# Altium schematic sheet LED7SEG.SchDoc
size A4
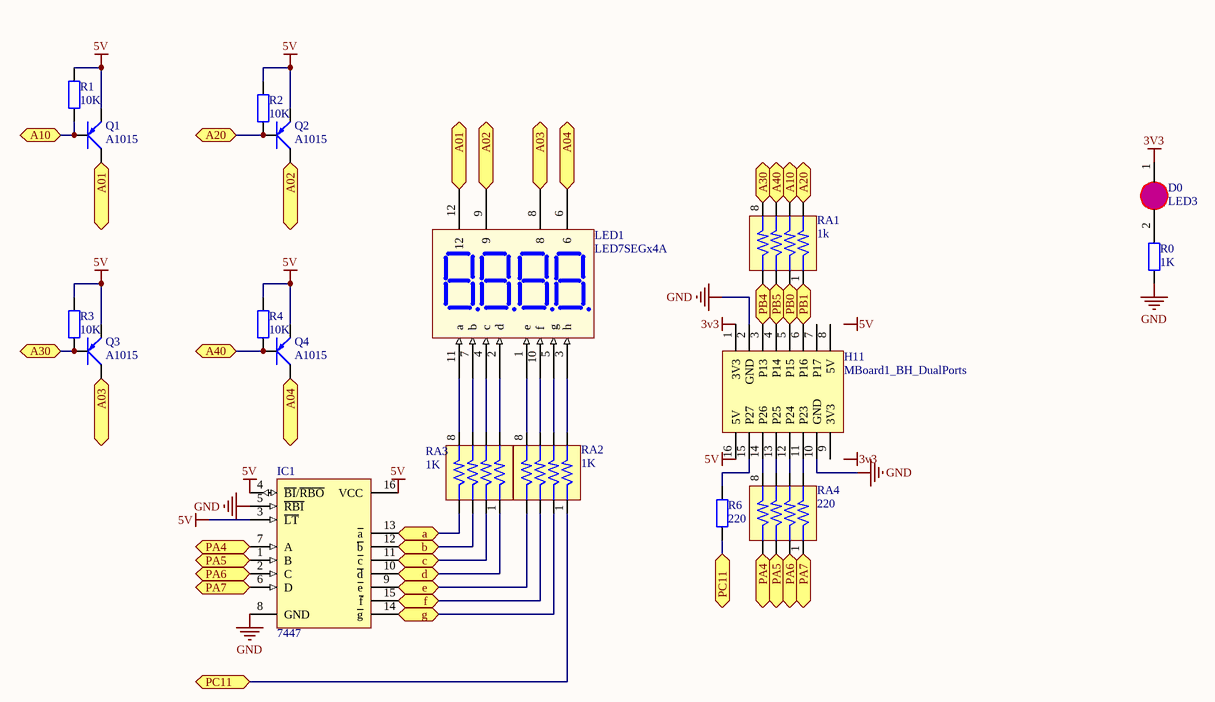
[diagram p0: LED7SEG.SchDoc]

## Parts
D0  LED3  [SMD0805LED]
H11  MBoard1_BH_DualPorts  [MBoard1_BH_DualPorts]
IC1  7447  [DIP16/W0.3]
LED1  LED7SEGx4A  [LED7SEGx4A]
Q1  A1015  [SOT23B]
Q2  A1015  [SOT23B]
Q3  A1015  [SOT23B]
Q4  A1015  [SOT23B]
R0  value 1K  [SMD0805R]  (hidden comment: R)
R1  value 10K  [SMD0805R]  (hidden comment: R)
R2  value 10K  [SMD0805R]  (hidden comment: R)
R3  value 10K  [SMD0805R]  (hidden comment: R)
R4  value 10K  [SMD0805R]  (hidden comment: R)
R6  value 220  [SMD0805R]  (hidden comment: R)
RA1  1k  [RA4]
RA2  1K  [RA4]
RA3  1K  [RA4]
RA4  220  [RA4]

## Ports
a, A01, A02, A03, A04, A10, A20, A30, A40, b, c, d, e, f, g, PA4, PA5, PA6, PA7, PB0, PB1, PB4, PB5, PC11

## Nets
3v3: D0.1(A) H11.1(3V3)
5V: H11.16(5V) IC1.3(~{LT}) IC1.4(~{BI}/~{RBO}) IC1.16(VCC) Q1.1(E) Q2.1(E) Q3.1(E) Q4.1(E) R1.2 R2.2 R3.2 R4.2
GND: H11.2(GND) H11.10(GND) IC1.5(~{RBI}) IC1.8(GND) R0.1
a: IC1.13(~{a}) RA3.7 ; port a
A01: LED1.12 Q1.2(C) ; port A01
A02: LED1.9 Q2.2(C) ; port A02
A03: LED1.8 Q3.2(C) ; port A03
A04: LED1.6 Q4.2(C) ; port A04
A10: Q1.3(B) R1.1 RA1.4 ; port A10
A20: Q2.3(B) R2.1 RA1.2 ; port A20
A30: Q3.3(B) R3.1 RA1.8 ; port A30
A40: Q4.3(B) R4.1 RA1.6 ; port A40
b: IC1.12(~{b}) RA3.5 ; port b
c: IC1.11(~{c}) RA3.3 ; port c
d: IC1.10(~{d}) RA3.1 ; port d
e: IC1.9(~{e}) RA2.7 ; port e
f: IC1.15(~{f}) RA2.5 ; port f
g: IC1.14(~{g}) RA2.3 ; port g
PA4: IC1.7(A) RA4.7 ; port PA4
PA5: IC1.1(B) RA4.5 ; port PA5
PA6: IC1.2(C) RA4.3 ; port PA6
PA7: IC1.6(D) RA4.1 ; port PA7
PB0: H11.5(P15) RA1.3 ; port PB0
PB1: H11.6(P16) RA1.1 ; port PB1
PB4: H11.3(P13) RA1.7 ; port PB4
PB5: H11.4(P14) RA1.5 ; port PB5
PC11: R6.1 RA2.1 ; port PC11
NetD0_2: D0.2(K) R0.2
NetH11_11: H11.11(P23) RA4.2
NetH11_12: H11.12(P24) RA4.4
NetH11_13: H11.13(P25) RA4.6
NetH11_14: H11.14(P26) RA4.8
NetH11_15: H11.15(P27) R6.2
NetLED1_1: LED1.1(e) RA2.8
NetLED1_2: LED1.2(d) RA3.2
NetLED1_3: LED1.3(h) RA2.2
NetLED1_4: LED1.4(c) RA3.4
NetLED1_5: LED1.5(g) RA2.4
NetLED1_7: LED1.7(b) RA3.6
NetLED1_10: LED1.10(f) RA2.6
NetLED1_11: LED1.11(a) RA3.8

Not connected (* = marked no-connect by the designer): H11 7(P17) 8(5V) 9(3V3)

## Notes on the sheet
- Labels drawn without touching a wire or pin: 3v3, 5V

## Library data of the parts
D0 = LEDSMD: LED SMD
IC1 = 7447: BCD to 7-Segment Decoder/Driver; Value: 7447 , 74247; Description: VanDungEvn
LED1 = LED7SEGx4A: 0.36''
Q1-Q4 = A1015: PNP 600mW, ECB; Value: A1015
R0-R4 R6 = R: RES_08; Published: 8-Jun-2000; LatestRevisionDate: 17-Jul-2002; LatestRevisionNote: Re-released for DXP Platform.; PackageReference: AXIAL-0.4; Publisher: Altium Limited
RA1-RA4 = RA4